# Altium project Capstone_Mainboard_B.PrjPcb (part 3 of 3)

## Sheet Management_RP2040_Support.SchDoc: Management Microcontroller Support
size B; CheckedBy: Jason Sullins; Author: Jordan Harris-Toovy; Revision: 0.2; SheetNumber: 3; SheetTotal: 22; Size: ANSI B
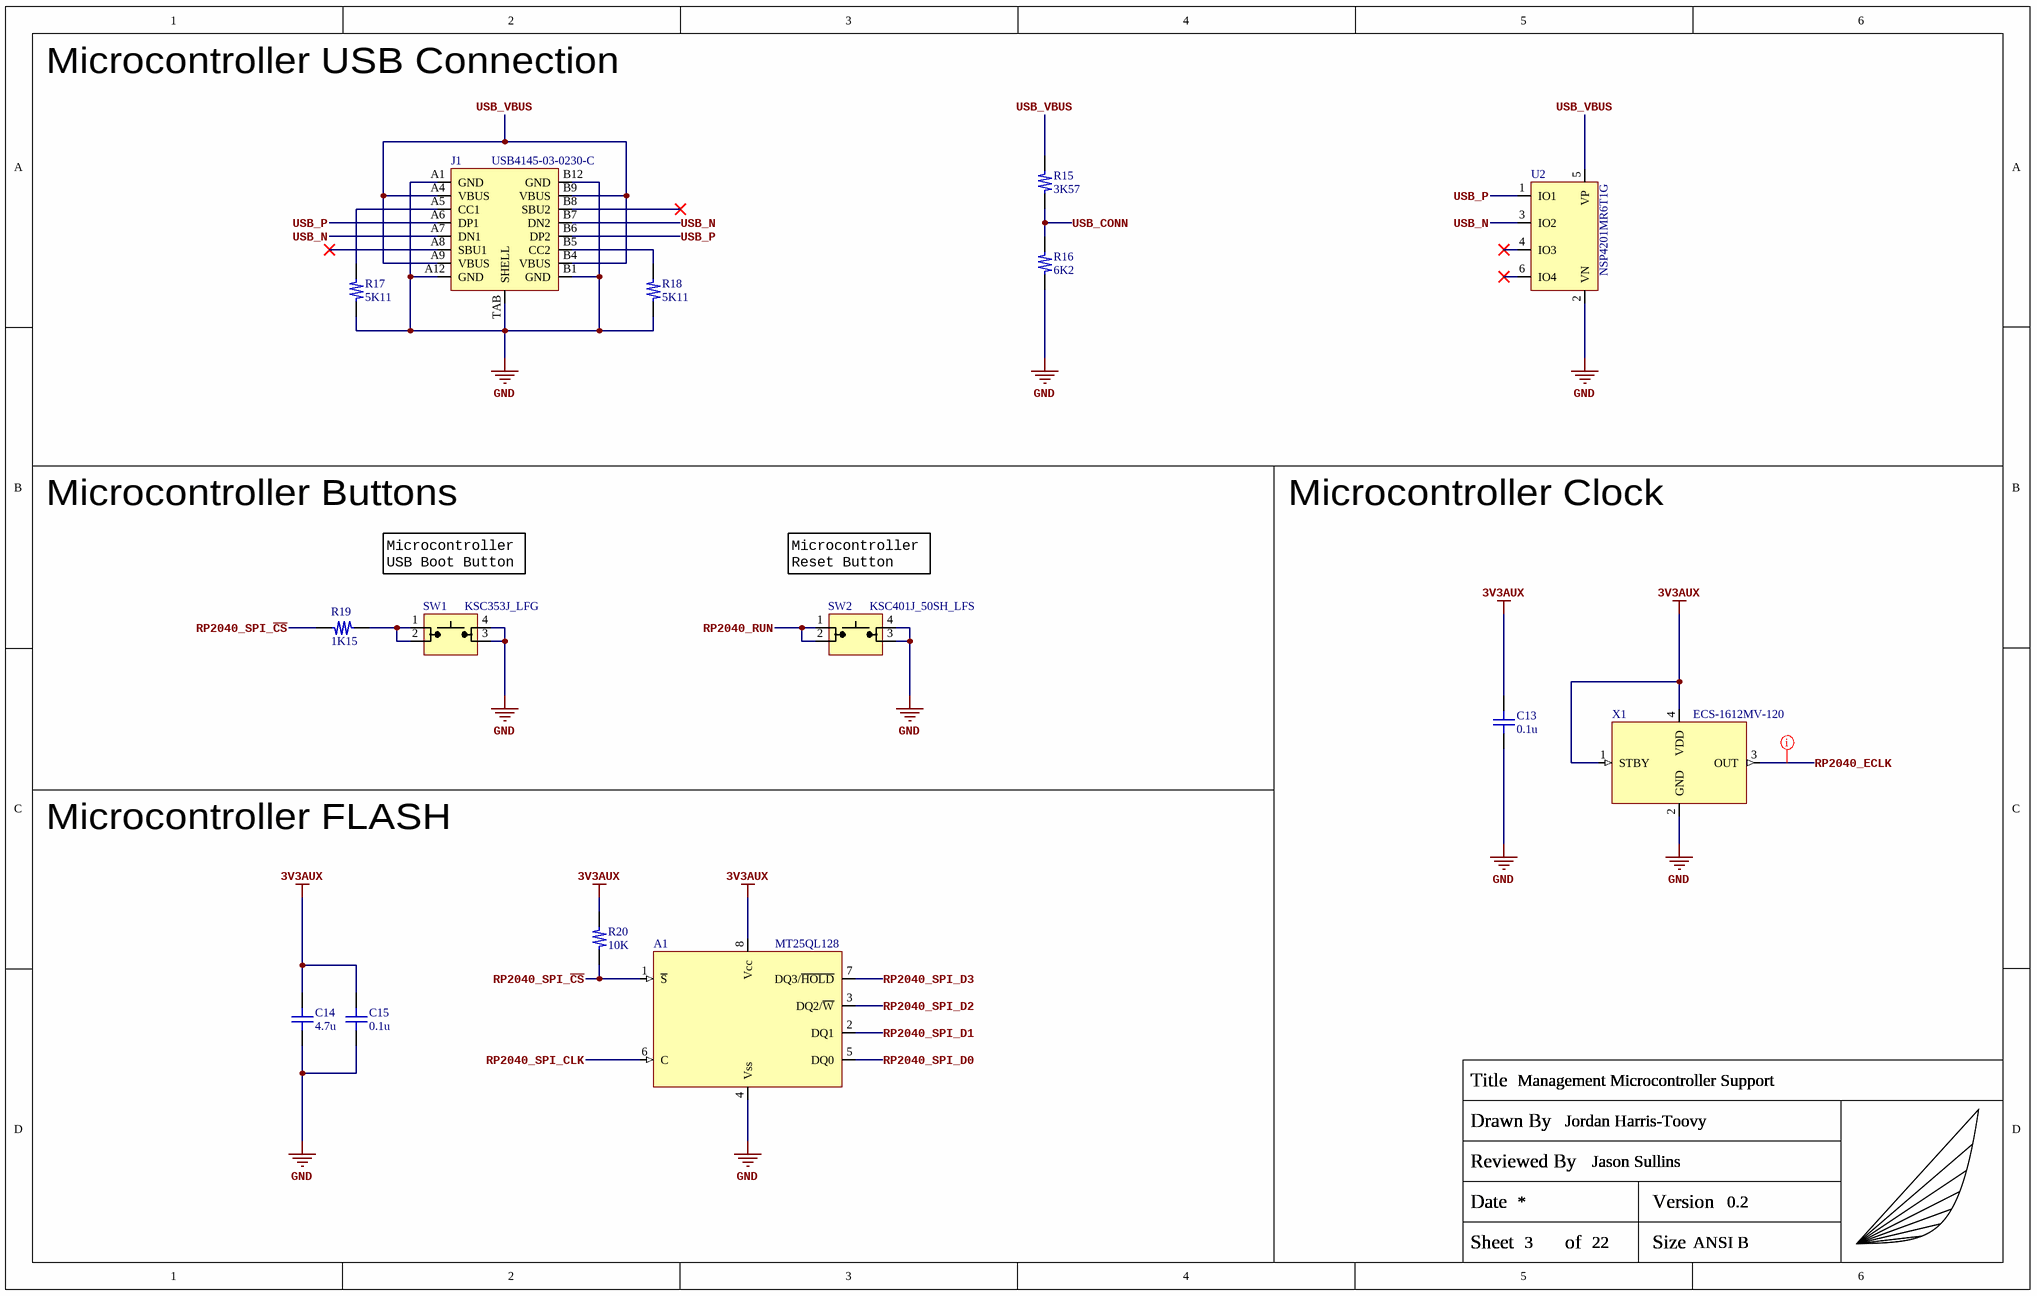
[diagram p20: Management_RP2040_Support.SchDoc]

### Parts
(Parts that share a designator on the sheet are numbered #1, #2 ... from top to bottom, then left to right.)
A1  MT25QL128  [LOTES_ACA-SPI-004-K01]
C13  0.1u  [C_0402_Generic]
C14  4.7u  [C_0402_Generic]
C15  0.1u  [C_0402_Generic]
J1  USB4145-03-0230-C  [USB4145-03-0230-C]
R15  3K57  [R_0402_Generic]
R16  6K2  [R_0402_Generic]
R17  5K11  [R_0402_Generic]
R18  5K11  [R_0402_Generic]
R19  1K15  [R_0402_Generic]
R20  10K  [R_0402_Generic]
SW1  KSC353J_LFG  [C&K_KSC_6.20]
SW2  KSC401J_50SH_LFS  [C&K_KSC_6.20]
TITLEBLOCK?#21  Capstone_Title_Block  (value not drawn)  (graphical)
U2  NSP4201MR6T1G  [ONSEMI_6-TSOP]
X1  ECS-1612MV-120  [ECS 4-SMD (1.6X1.2)]

### Nets
3V3AUX: A1.8(Vcc) C13.2 C14.2 C15.2 R20.2 X1.1(STBY) X1.4(VDD)
GND: A1.4(Vss) C13.1 C14.1 C15.1 J1.A1(GND) J1.A12(GND) J1.B1(GND) J1.B12(GND) J1.TAB(SHELL) R16.1 R17.1 R18.1 SW1.3(P3) SW1.4(P4) SW2.3(P3) SW2.4(P4) U2.2(VN) X1.2(GND)
RP2040_ECLK: X1.3(OUT)
RP2040_RUN: SW2.1(P1) SW2.2(P2)
RP2040_SPI_~{CS}: A1.1(~{S}) R19.2 R20.1
RP2040_SPI_CLK: A1.6(C)
RP2040_SPI_D0: A1.5(DQ0)
RP2040_SPI_D1: A1.2(DQ1)
RP2040_SPI_D2: A1.3(DQ2/~{W})
RP2040_SPI_D3: A1.7(DQ3/~{HOLD})
USB_CONN: R15.1 R16.2
USB_N: J1.A7(DN1) J1.B7(DN2) U2.3(IO2)
USB_P: J1.A6(DP1) J1.B6(DP2) U2.1(IO1)
USB_VBUS: J1.A4(VBUS) J1.A9(VBUS) J1.B4(VBUS) J1.B9(VBUS) R15.2 U2.5(VP)
NetJ1_A5: J1.A5(CC1) R17.2
NetJ1_B5: J1.B5(CC2) R18.2
NetR19_1: R19.1 SW1.1(P1) SW1.2(P2)

Not connected (* = marked no-connect by the designer): J1 A8(SBU1)* B8(SBU2)*; U2 4(IO3)* 6(IO4)*

### Layout directives
net class SE50_GENERAL: RP2040_ECLK

### Notes on the sheet
- Microcontroller USB Connection
- Microcontroller Buttons
- Microcontroller Clock
- Microcontroller USB Boot Button
- Microcontroller Reset Button
- Microcontroller FLASH
- (in symbol Capstone_Title_Block) Title; Drawn By; Reviewed By; Date; Version; Sheet; of; Size

### Library data of the parts
A1 = MT25QL128ABA1ESE_ACA-SPI-004: FLASH - NOR Memory IC 128Mbit SPI (Q)SPI 133 MHz 8-SO In ACA-SPI-004-K01 socket; Manufacturer: Micron Technology Inc; Manufacturer Part Number: MT25QL128ABA1ESE; Manufacturer2: LOTES; Manufacturer2 Part Number: ACA-SPI-004-K01
C13 C15 = GRM155R71C104KA88D: 0.1µF 16V X7R SMD ceramic capacitor in 0402 size; Manufacturer: Murata Electronics; Manufacturer Part Number: GRM155R71C104KA88D
C14 = GRM155R61A475MEAAJ: as C102-C104 on sheet FPGA_Power; Manufacturer Part Number: GRM155R61A475MEAAJ
J1 = USB4145-03-0230-C: USB 2.0 TYPE-C RECPT VERT XL TABS SMT; Manufacturer: GCT; Manufacturer Part Number: USB4145-03-0230-C
R15 = ERJ-2RKF3571X: 3.57KOhm 1% 1/10W SMD resistor in 0402 size; Manufacturer: Panasonic; Manufacturer Part Number: ERJ-2RKF3571X
R16 = ERJ-2RKF6201X: 6.2KOhm 1% 1/10W SMD resistor in 0402 size; Manufacturer: Panasonic; Manufacturer Part Number: ERJ-2RKF6201X
R17 R18 = ERJ-2RKF5111X: 5.11KOhm 1% 1/10W SMD resistor in 0402 size; Manufacturer: Panasonic; Manufacturer Part Number: ERJ-2RKF5111X
R19 = ERJ-2RKF1151X: 1.15KOhm 1% 1/10W SMD resistor in 0402 size; Manufacturer: Panasonic; Manufacturer Part Number: ERJ-2RKF1151X
R20 = ERJ-2RKF1002X: as R7-R14 on sheet Management_RP2040; Manufacturer Part Number: ERJ-2RKF1002X
SW1 = KSC353J_LFG: Tactile Switch SPST-NO (MOM) SMD back actuator; Manufacturer: C&K; Manufacturer Part Number: KSC353J LFG
SW2 = KSC401J_50SH_LFS: Tactile Switch SPST-NO (MOM) SMD red long actuator; Manufacturer: C&K; Manufacturer Part Number: KSC401J 50SH LFS
TITLEBLOCK?#21 = Capstone_Title_Block: Custom title block with personal logo; Manufacturer: NONE; Manufacturer Part Number: NONE
U2 = NSP4201MR6T1G: 4CH 6V Break 12V Clamp TVS Diode USB; Manufacturer: onsemi; Manufacturer Part Number: NSP4201MR6T1G
X1 = ECS-1612MV-120-CN-TR: 12 MHz XO (Standard) CMOS Oscillator 1.6V ~ 3.63V Standby (Power Down) 4-SMD, No Lead; Manufacturer: ECS Inc; Manufacturer Part Number: ECS-1612MV-120-CN-TR

## Sheet PMIC_3V3AUX_PWR-DEF.SchDoc: 3.3V Auxiliary Power Supply and Power Net Class Definitions
size B; CheckedBy: Jason Sullins; Author: Jordan Harris-Toovy; Revision: 0.2; SheetNumber: 15; SheetTotal: 22; Size: ANSI B
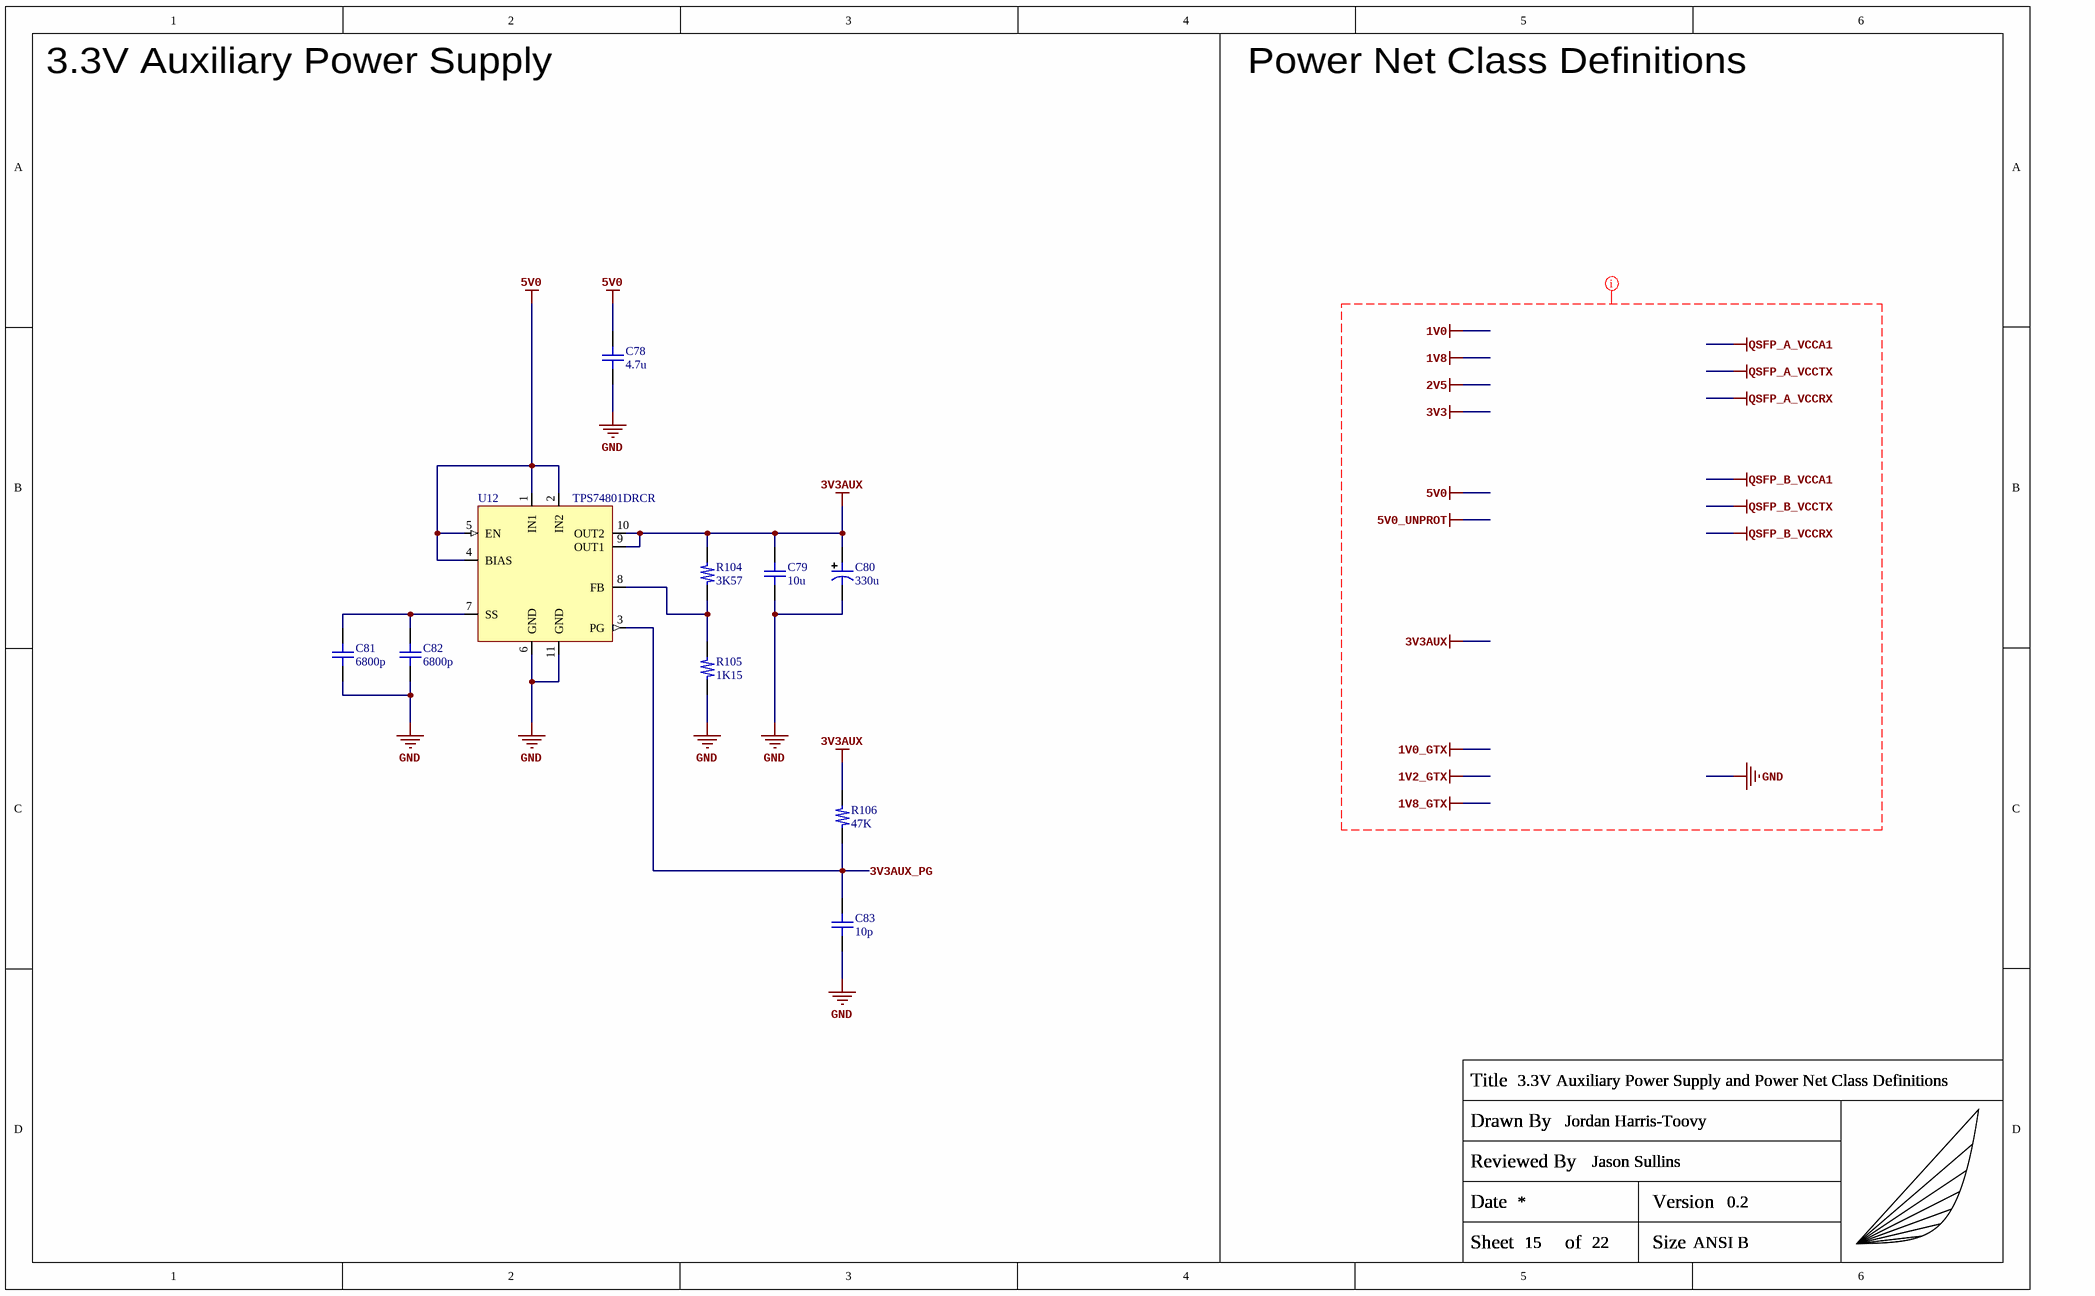
[diagram p21: PMIC_3V3AUX_PWR-DEF.SchDoc]

### Parts
(Parts that share a designator on the sheet are numbered #1, #2 ... from top to bottom, then left to right.)
C78  4.7u  [C_0402_Generic]
C79  10u  [C_0402_Generic]
C80  330u  [KEMET_EK_Radial]
C81  6800p  [C_0402_Generic]
C82  6800p  [C_0402_Generic]
C83  10p  [C_0402_Generic]
R104  3K57  [R_0402_Generic]
R105  1K15  [R_0402_Generic]
R106  47K  [R_0402_Generic]
TITLEBLOCK?#22  Capstone_Title_Block  (value not drawn)  (graphical)
U12  TPS74801DRCR  [TI_10VSON_DRC0010J_ADDVIA]

### Nets
3V3AUX: C79.2 C80.1 R104.2 R106.2 U12.9(OUT1) U12.10(OUT2)
5V0: C78.2 U12.1(IN1) U12.2(IN2) U12.4(BIAS) U12.5(EN)
GND: C78.1 C79.1 C80.2 C81.1 C82.1 C83.1 R105.1 U12.6(GND) U12.11(GND)
3V3AUX_PG: C83.2 R106.1 U12.3(PG)
NetC81_2: C81.2 C82.2 U12.7(SS)
NetR104_1: R104.1 R105.2 U12.8(FB)

### Layout directives
net class POWER: 1V0, 1V0_GTX, 1V2_GTX, 1V8, 1V8_GTX, 2V5, 3V3, 3V3AUX, 5V0, 5V0_UNPROT, GND, QSFP_A_VCCA1, QSFP_A_VCCRX, QSFP_A_VCCTX, QSFP_B_VCCA1, QSFP_B_VCCRX, QSFP_B_VCCTX

### Notes on the sheet
- 3.3V Auxiliary Power Supply
- Power Net Class Definitions
- (in symbol Capstone_Title_Block) Title; Drawn By; Reviewed By; Date; Version; Sheet; of; Size

### Library data of the parts
C78 = GRM155R61A475MEAAJ: as C102-C104 on sheet FPGA_Power; Manufacturer Part Number: GRM155R61A475MEAAJ
C79 = CC0402MRX5R6BB106: 10µF 10V X5R SMD ceramic capacitor in 0402 size; Manufacturer: YAGEO; Manufacturer Part Number: CC0402MRX5R6BB106
C80 = A759EK337M1AAAE018: 330µF 10V Aluminum polymer capacitor, KEMET EK; Manufacturer: KEMET; Manufacturer Part Number: A759EK337M1AAAE018
C81 C82 = GRM155R71E682KA01D: 6800pF 25V X7R SMD ceramic capacitor in 0402 size; Manufacturer: Murata Electronics; Manufacturer Part Number: GRM155R71E682KA01D
C83 = GRM1555C1H100JA01D: 10pF 50V C0G/NP0 SMD ceramic capacitor in 0402 size; Manufacturer: Murata Electronics; Manufacturer Part Number: GRM1555C1H100JA01D
R104 = ERJ-2RKF3571X: as R15 on sheet Management_RP2040_Support; Manufacturer Part Number: ERJ-2RKF3571X
R105 = ERJ-2RKF1151X: as R19 on sheet Management_RP2040_Support; Manufacturer Part Number: ERJ-2RKF1151X
R106 = ERJ-2RKF4702X: 47KOhm 1% 1/10W SMD resistor in 0402 size; Manufacturer: Panasonic; Manufacturer Part Number: ERJ-2RKF4702X
TITLEBLOCK?#22 = Capstone_Title_Block: as TITLEBLOCK?#21 on sheet Management_RP2040_Support; Manufacturer Part Number: NONE
U12 = TPS74801DRCR: LDO 1.5A 10-VSON; Manufacturer: Texas Instruments; Manufacturer Part Number: TPS74801DRCR

## Nets that join several sheets
1V0: PMIC_1V0 (5 pins), FPGA_Power (26 pins)
1V0_GTX: FPGA_Power (6 pins), PMIC_GTXs (6 pins)
1V2_GTX: FPGA_Power (8 pins), FPGA_GTXs (NT9.2), PMIC_GTXs (6 pins)
1V8: HPCC_Connector_A (6 pins), HPCC_Connector_B (6 pins), PMIC_1V8 (5 pins), FPGA_Power (32 pins), FPGA_HPCC_A_DPs (R119.2), PMIC_GTXs (10 pins)
1V8_GTX: FPGA_Power (C104.2 U16.N6), PMIC_GTXs (6 pins)
2V5: PMIC_2V5 (7 pins), FPGA_Power (20 pins), PMIC_GTXs (5 pins)
3V3: Flash_FPGA (7 pins), I2C_Switch_EEPROM (23 pins), QSFP_Connectors (16 pins), HPCC_Connector_A (12 pins), HPCC_Connector_B (12 pins), PMIC_3V3 (5 pins), FPGA_Power (18 pins), FGPA_Configuration (R117.2 R118.2 U16.P7), FPGA_GTXs (C120.1 U17.1 U17.6), Miscellaneous_Functions (11 pins)
3V3AUX: HPCC_Connector_A (J6.A11), HPCC_Connector_B (J7.A11), PMIC_3V3 (R102.2), PMIC_2V5 (R97.2), PMIC_1V8 (R90.2), PMIC_1V0 (R84.2), I2C_Temperature_Sensors (7 pins), Management_RP2040 (22 pins), Power_Input_Indicators (R24.2), PMIC_GTXs (11 pins), Management_RP2040_Support (7 pins), PMIC_3V3AUX_PWR-DEF (6 pins)
5V0: PMIC_3V3 (8 pins), PMIC_2V5 (8 pins), PMIC_1V8 (7 pins), PMIC_1V0 (7 pins), Power_Input_Indicators (15 pins), PMIC_3V3AUX_PWR-DEF (5 pins)
GND: Flash_FPGA (A2.4 C122.1), I2C_Switch_EEPROM (10 pins), QSFP_Connectors (64 pins), HPCC_Connector_A (209 pins), HPCC_Connector_B (209 pins), PMIC_3V3 (12 pins), PMIC_2V5 (14 pins), PMIC_1V8 (13 pins), PMIC_1V0 (13 pins), I2C_Temperature_Sensors (7 pins), Management_RP2040 (23 pins), FPGA_Power (138 pins), FGPA_Configuration (38 pins), FPGA_HPCC_A_DPs (5 pins), FPGA_HPCC_B_DPs (6 pins), FPGA_GTXs (C120.2 U17.3), Power_Input_Indicators (28 pins), Miscellaneous_Functions (25 pins), PMIC_GTXs (24 pins), Management_RP2040_Support (18 pins), PMIC_3V3AUX_PWR-DEF (9 pins)
1V0_EN: PMIC_1V0 (R80.2), Management_RP2040 (R7.2 U1.11)
1V0_GTX_EN: Management_RP2040 (R12.2 U1.16), PMIC_GTXs (U13.6)
1V0_GTX_PG: Management_RP2040 (U1.8), PMIC_GTXs (R107.1 U13.5)
1V0_PG: PMIC_1V0 (C48.2 R85.1), Management_RP2040 (U1.4)
1V2_GTX_EN: Management_RP2040 (R13.2 U1.17), PMIC_GTXs (U15.6)
1V2_GTX_PG: Management_RP2040 (U1.9), PMIC_GTXs (R113.1 U15.5)
1V8_EN: PMIC_1V8 (R86.2), Management_RP2040 (R9.2 U1.13)
1V8_GTX_EN: Management_RP2040 (R14.2 U1.18), PMIC_GTXs (U14.6)
1V8_PG: PMIC_1V8 (C57.2 R91.1), Management_RP2040 (U1.5)
2V5_EN: PMIC_2V5 (R92.2), Management_RP2040 (R10.2 U1.14)
2V5_PG: PMIC_2V5 (C68.2 R98.1), Management_RP2040 (U1.6)
3V3_EN: PMIC_3V3 (R99.2), Management_RP2040 (R11.2 U1.15)
3V3_PG: PMIC_3V3 (C77.2 R103.1), Management_RP2040 (U1.7)
3V3AUX_PG: Management_RP2040 (U1.3), PMIC_3V3AUX_PWR-DEF (C83.2 R106.1 U12.3)
EXT_CLK_IN: FGPA_Configuration (U16.G22), Miscellaneous_Functions (J11.1)
EXT_CONF_CLK_IN: FGPA_Configuration (U16.B26), Miscellaneous_Functions (J12.1)
FLASH_FPGA_C: Flash_FPGA (A2.6), FGPA_Configuration (U16.C8)
FLASH_FPGA_DQ0: Flash_FPGA (R130.1), FGPA_Configuration (U16.B24)
FLASH_FPGA_DQ1: Flash_FPGA (R129.1), FGPA_Configuration (U16.A25)
FLASH_FPGA_DQ2: Flash_FPGA (R128.1), FGPA_Configuration (U16.B22)
FLASH_FPGA_DQ3: Flash_FPGA (R127.1), FGPA_Configuration (U16.A22)
FLASH_FPGA_~{S}: Flash_FPGA (A2.1 R122.1), FGPA_Configuration (U16.C23)
FPGA_CK200_N: FGPA_Configuration (U16.E23), Miscellaneous_Functions (U18.5)
FPGA_CK200_P: FGPA_Configuration (U16.F22), Miscellaneous_Functions (U18.4)
FPGA_CONF_M0: FGPA_Configuration (U16.T5), Miscellaneous_Functions (R138.2 SW3.1)
FPGA_CONF_M1: FGPA_Configuration (U16.T2), Miscellaneous_Functions (R137.2 SW3.2)
FPGA_CONF_M2: FGPA_Configuration (U16.P5), Miscellaneous_Functions (R136.2 SW3.3)
FPGA_CONFDONE: Management_RP2040 (U1.30), FGPA_Configuration (U16.J7)
FPGA_INIT/CRCERR: Management_RP2040 (U1.31), FGPA_Configuration (R117.1 U16.G7), Miscellaneous_Functions (SW3.4)
FPGA_JTAG_TCK: FGPA_Configuration (U16.L8), Miscellaneous_Functions (J8.4)
FPGA_JTAG_TDI: FGPA_Configuration (U16.R6), Miscellaneous_Functions (J8.3)
FPGA_JTAG_TDO: FGPA_Configuration (U16.R7), Miscellaneous_Functions (J8.6)
FPGA_JTAG_TMS: FGPA_Configuration (U16.N8), Miscellaneous_Functions (J8.2)
FPGA_~{RESET}: Management_RP2040 (U1.32), FGPA_Configuration (R118.1 TP11.1 U16.P6)
HPCC_A_01_N: HPCC_Connector_A (J6.B21), FPGA_HPCC_A_DPs (U16.AE11)
HPCC_A_01_P: HPCC_Connector_A (J6.B20), FPGA_HPCC_A_DPs (U16.AD11)
HPCC_A_02_N: HPCC_Connector_A (J6.B25), FPGA_HPCC_A_DPs (U16.AF9)
HPCC_A_02_P: HPCC_Connector_A (J6.B24), FPGA_HPCC_A_DPs (U16.AF10)
HPCC_A_03_N: HPCC_Connector_A (J6.B29), FPGA_HPCC_A_DPs (U16.AF7)
HPCC_A_03_P: HPCC_Connector_A (J6.B28), FPGA_HPCC_A_DPs (U16.AE7)
HPCC_A_04_N: HPCC_Connector_A (J6.B33), FPGA_HPCC_A_DPs (U16.AE5)
HPCC_A_04_P: HPCC_Connector_A (J6.B32), FPGA_HPCC_A_DPs (U16.AE6)
HPCC_A_05_N: HPCC_Connector_A (J6.B37), FPGA_HPCC_A_DPs (U16.AE2)
HPCC_A_05_P: HPCC_Connector_A (J6.B36), FPGA_HPCC_A_DPs (U16.AE3)
HPCC_A_06_N: HPCC_Connector_A (J6.C3), FPGA_HPCC_A_DPs (U16.AE20)
HPCC_A_06_P: HPCC_Connector_A (J6.C2), FPGA_HPCC_A_DPs (U16.AD20)
HPCC_A_07_N: HPCC_Connector_A (J6.C7), FPGA_HPCC_A_DPs (U16.AF18)
HPCC_A_07_P: HPCC_Connector_A (J6.C6), FPGA_HPCC_A_DPs (U16.AE18)
HPCC_A_08_N: HPCC_Connector_A (J6.C11), FPGA_HPCC_A_DPs (U16.AE16)
HPCC_A_08_P: HPCC_Connector_A (J6.C10), FPGA_HPCC_A_DPs (U16.AD16)
HPCC_A_09_N: HPCC_Connector_A (J6.C15), FPGA_HPCC_A_DPs (U16.AF15)
HPCC_A_09_P: HPCC_Connector_A (J6.C14), FPGA_HPCC_A_DPs (U16.AF14)
HPCC_A_10_N: HPCC_Connector_A (J6.C19), FPGA_HPCC_A_DPs (U16.AF12)
HPCC_A_10_P: HPCC_Connector_A (J6.C18), FPGA_HPCC_A_DPs (U16.AE12)
HPCC_A_11_N: HPCC_Connector_A (J6.C23), FPGA_HPCC_A_DPs (U16.AE10)
HPCC_A_11_P: HPCC_Connector_A (J6.C22), FPGA_HPCC_A_DPs (U16.AD10)
HPCC_A_12_N: HPCC_Connector_A (J6.C27), FPGA_HPCC_A_DPs (U16.AF8)
HPCC_A_12_P: HPCC_Connector_A (J6.C26), FPGA_HPCC_A_DPs (U16.AE8)
HPCC_A_13_N: HPCC_Connector_A (J6.C31), FPGA_HPCC_A_DPs (U16.AD5)
HPCC_A_13_P: HPCC_Connector_A (J6.C30), FPGA_HPCC_A_DPs (U16.AD6)
HPCC_A_14_N: HPCC_Connector_A (J6.C35), FPGA_HPCC_A_DPs (U16.AF4)
HPCC_A_14_P: HPCC_Connector_A (J6.C34), FPGA_HPCC_A_DPs (U16.AF5)
HPCC_A_15_N: HPCC_Connector_A (J6.C39), FPGA_HPCC_A_DPs (U16.AE1)
HPCC_A_15_P: HPCC_Connector_A (J6.C38), FPGA_HPCC_A_DPs (U16.AD1)
HPCC_A_16_N: HPCC_Connector_A (J6.D5), FPGA_HPCC_A_DPs (U16.AF20)
HPCC_A_16_P: HPCC_Connector_A (J6.D4), FPGA_HPCC_A_DPs (U16.AF19)
HPCC_A_17_N: HPCC_Connector_A (J6.D9), FPGA_HPCC_A_DPs (U16.AF17)
HPCC_A_17_P: HPCC_Connector_A (J6.D8), FPGA_HPCC_A_DPs (U16.AE17)
HPCC_A_18_N: HPCC_Connector_A (J6.D13), FPGA_HPCC_A_DPs (U16.AE15)
HPCC_A_18_P: HPCC_Connector_A (J6.D12), FPGA_HPCC_A_DPs (U16.AD15)
HPCC_A_19_N: HPCC_Connector_A (J6.D17), FPGA_HPCC_A_DPs (U16.AF13)
HPCC_A_19_P: HPCC_Connector_A (J6.D16), FPGA_HPCC_A_DPs (U16.AE13)
HPCC_A_20_N: HPCC_Connector_A (J6.D21), FPGA_HPCC_A_DPs (U16.AB10)
HPCC_A_20_P: HPCC_Connector_A (J6.D20), FPGA_HPCC_A_DPs (U16.AA10)
HPCC_A_21_N: HPCC_Connector_A (J6.D25), FPGA_HPCC_A_DPs (U16.AD8)
HPCC_A_21_P: HPCC_Connector_A (J6.D24), FPGA_HPCC_A_DPs (U16.AC8)
HPCC_A_22_N: HPCC_Connector_A (J6.D29), FPGA_HPCC_A_DPs (U16.AC6)
HPCC_A_22_P: HPCC_Connector_A (J6.D28), FPGA_HPCC_A_DPs (U16.AB6)
HPCC_A_23_N: HPCC_Connector_A (J6.D33), FPGA_HPCC_A_DPs (U16.AC3)
HPCC_A_23_P: HPCC_Connector_A (J6.D32), FPGA_HPCC_A_DPs (U16.AC4)
HPCC_A_24_N: HPCC_Connector_A (J6.D37), FPGA_HPCC_A_DPs (U16.AC2)
HPCC_A_24_P: HPCC_Connector_A (J6.D36), FPGA_HPCC_A_DPs (U16.AB2)
HPCC_A_25_N: HPCC_Connector_A (J6.E3), FPGA_HPCC_A_DPs (U16.AB20)
HPCC_A_25_P: HPCC_Connector_A (J6.E2), FPGA_HPCC_A_DPs (U16.AB19)
HPCC_A_26_N: HPCC_Connector_A (J6.E7), FPGA_HPCC_A_DPs (U16.AC17)
HPCC_A_26_P: HPCC_Connector_A (J6.E6), FPGA_HPCC_A_DPs (U16.AB17)
HPCC_A_27_N: HPCC_Connector_A (J6.E11), FPGA_HPCC_A_DPs (U16.AB15)
HPCC_A_27_P: HPCC_Connector_A (J6.E10), FPGA_HPCC_A_DPs (U16.AB14)
HPCC_A_28_N: HPCC_Connector_A (J6.E15), FPGA_HPCC_A_DPs (U16.AD13)
HPCC_A_28_P: HPCC_Connector_A (J6.E14), FPGA_HPCC_A_DPs (U16.AC13)
HPCC_A_29_N: HPCC_Connector_A (J6.E19), FPGA_HPCC_A_DPs (U16.AC11)
HPCC_A_29_P: HPCC_Connector_A (J6.E18), FPGA_HPCC_A_DPs (U16.AB11)
HPCC_A_30_N: HPCC_Connector_A (J6.E23), FPGA_HPCC_A_DPs (U16.AD9)
HPCC_A_30_P: HPCC_Connector_A (J6.E22), FPGA_HPCC_A_DPs (U16.AC9)
HPCC_A_31_N: HPCC_Connector_A (J6.E27), FPGA_HPCC_A_DPs (U16.AC7)
HPCC_A_31_P: HPCC_Connector_A (J6.E26), FPGA_HPCC_A_DPs (U16.AB7)
HPCC_A_32_N: HPCC_Connector_A (J6.E31), FPGA_HPCC_A_DPs (U16.AB5)
HPCC_A_32_P: HPCC_Connector_A (J6.E30), FPGA_HPCC_A_DPs (U16.AA5)
HPCC_A_33_N: HPCC_Connector_A (J6.E35), FPGA_HPCC_A_DPs (U16.AD3)
HPCC_A_33_P: HPCC_Connector_A (J6.E34), FPGA_HPCC_A_DPs (U16.AD4)
HPCC_A_34_N: HPCC_Connector_A (J6.E39), FPGA_HPCC_A_DPs (U16.AF2)
HPCC_A_34_P: HPCC_Connector_A (J6.E38), FPGA_HPCC_A_DPs (U16.AF3)
HPCC_A_35_N: HPCC_Connector_A (J6.F5), FPGA_HPCC_A_DPs (U16.AD18)
HPCC_A_35_P: HPCC_Connector_A (J6.F4), FPGA_HPCC_A_DPs (U16.AC18)
HPCC_A_36_N: HPCC_Connector_A (J6.F9), FPGA_HPCC_A_DPs (U16.AC16)
HPCC_A_36_P: HPCC_Connector_A (J6.F8), FPGA_HPCC_A_DPs (U16.AB16)
HPCC_A_37_N: HPCC_Connector_A (J6.F13), FPGA_HPCC_A_DPs (U16.AD14)
HPCC_A_37_P: HPCC_Connector_A (J6.F12), FPGA_HPCC_A_DPs (U16.AC14)
HPCC_A_38_N: HPCC_Connector_A (J6.F17), FPGA_HPCC_A_DPs (U16.AC12)
HPCC_A_38_P: HPCC_Connector_A (J6.F16), FPGA_HPCC_A_DPs (U16.AB12)
HPCC_A_39_N: HPCC_Connector_A (J6.F21), FPGA_HPCC_A_DPs (U16.Y12)
HPCC_A_39_P: HPCC_Connector_A (J6.F20), FPGA_HPCC_A_DPs (U16.Y13)
HPCC_A_40_N: HPCC_Connector_A (J6.F25), FPGA_HPCC_A_DPs (U16.AB9)
HPCC_A_40_P: HPCC_Connector_A (J6.F24), FPGA_HPCC_A_DPs (U16.AA9)
HPCC_A_41_N: HPCC_Connector_A (J6.F29), FPGA_HPCC_A_DPs (U16.AA7)
HPCC_A_41_P: HPCC_Connector_A (J6.F28), FPGA_HPCC_A_DPs (U16.AA8)
HPCC_A_42_N: HPCC_Connector_A (J6.F33), FPGA_HPCC_A_DPs (U16.Y5)
HPCC_A_42_P: HPCC_Connector_A (J6.F32), FPGA_HPCC_A_DPs (U16.Y6)
HPCC_A_43_N: HPCC_Connector_A (J6.F37), FPGA_HPCC_A_DPs (U16.AA2)
HPCC_A_43_P: HPCC_Connector_A (J6.F36), FPGA_HPCC_A_DPs (U16.AA3)
HPCC_A_44_N: HPCC_Connector_A (J6.G3), FPGA_HPCC_A_DPs (U16.AD19)
HPCC_A_44_P: HPCC_Connector_A (J6.G2), FPGA_HPCC_A_DPs (U16.AC19)
HPCC_A_45_N: HPCC_Connector_A (J6.G7), FPGA_HPCC_A_DPs (U16.AA20)
HPCC_A_45_P: HPCC_Connector_A (J6.G6), FPGA_HPCC_A_DPs (U16.AA19)
HPCC_A_46_N: HPCC_Connector_A (J6.G11), FPGA_HPCC_A_DPs (U16.AA18)
HPCC_A_46_P: HPCC_Connector_A (J6.G10), FPGA_HPCC_A_DPs (U16.AA17)
HPCC_A_47_N: HPCC_Connector_A (J6.G15), FPGA_HPCC_A_DPs (U16.Y16)
HPCC_A_47_P: HPCC_Connector_A (J6.G14), FPGA_HPCC_A_DPs (U16.Y15)
HPCC_A_48_N: HPCC_Connector_A (J6.G19), FPGA_HPCC_A_DPs (U16.AA12)
HPCC_A_48_P: HPCC_Connector_A (J6.G18), FPGA_HPCC_A_DPs (U16.AA13)
HPCC_A_49_N: HPCC_Connector_A (J6.G23), FPGA_HPCC_A_DPs (U16.Y10)
HPCC_A_49_P: HPCC_Connector_A (J6.G22), FPGA_HPCC_A_DPs (U16.Y11)
HPCC_A_50_N: HPCC_Connector_A (J6.G27), FPGA_HPCC_A_DPs (U16.Y7)
HPCC_A_50_P: HPCC_Connector_A (J6.G26), FPGA_HPCC_A_DPs (U16.Y8)
HPCC_A_51_N: HPCC_Connector_A (J6.G31), FPGA_HPCC_A_DPs (U16.W5)
HPCC_A_51_P: HPCC_Connector_A (J6.G30), FPGA_HPCC_A_DPs (U16.W6)
HPCC_A_52_N: HPCC_Connector_A (J6.G35), FPGA_HPCC_A_DPs (U16.AB4)
HPCC_A_52_P: HPCC_Connector_A (J6.G34), FPGA_HPCC_A_DPs (U16.AA4)
HPCC_A_53_N: HPCC_Connector_A (J6.G39), FPGA_HPCC_A_DPs (U16.AC1)
HPCC_A_53_P: HPCC_Connector_A (J6.G38), FPGA_HPCC_A_DPs (U16.AB1)
HPCC_A_54_N: HPCC_Connector_A (J6.H5), FPGA_HPCC_A_DPs (U16.W19)
HPCC_A_54_P: HPCC_Connector_A (J6.H4), FPGA_HPCC_A_DPs (U16.W18)
HPCC_A_55_N: HPCC_Connector_A (J6.H9), FPGA_HPCC_A_DPs (U16.Y18)
HPCC_A_55_P: HPCC_Connector_A (J6.H8), FPGA_HPCC_A_DPs (U16.Y17)
HPCC_A_56_N: HPCC_Connector_A (J6.H13), FPGA_HPCC_A_DPs (U16.V17)
HPCC_A_56_P: HPCC_Connector_A (J6.H12), FPGA_HPCC_A_DPs (U16.V16)
HPCC_A_57_N: HPCC_Connector_A (J6.H17), FPGA_HPCC_A_DPs (U16.AA15)
HPCC_A_57_P: HPCC_Connector_A (J6.H16), FPGA_HPCC_A_DPs (U16.AA14)
HPCC_A_58_N: HPCC_Connector_A (J6.H21), FPGA_HPCC_A_DPs (U16.W8)
HPCC_A_58_P: HPCC_Connector_A (J6.H20), FPGA_HPCC_A_DPs (U16.V9)
HPCC_A_59_N: HPCC_Connector_A (J6.H25), FPGA_HPCC_A_DPs (U16.V6)
HPCC_A_59_P: HPCC_Connector_A (J6.H24), FPGA_HPCC_A_DPs (U16.U7)
HPCC_A_60_N: HPCC_Connector_A (J6.H29), FPGA_HPCC_A_DPs (U16.W4)
HPCC_A_60_P: HPCC_Connector_A (J6.H28), FPGA_HPCC_A_DPs (U16.V4)
HPCC_A_61_N: HPCC_Connector_A (J6.H33), FPGA_HPCC_A_DPs (U16.U1)
HPCC_A_61_P: HPCC_Connector_A (J6.H32), FPGA_HPCC_A_DPs (U16.U2)
HPCC_A_62_N: HPCC_Connector_A (J6.H37), FPGA_HPCC_A_DPs (U16.Y2)
HPCC_A_62_P: HPCC_Connector_A (J6.H36), FPGA_HPCC_A_DPs (U16.Y3)
HPCC_A_63_N: HPCC_Connector_A (J6.J3), FPGA_HPCC_A_DPs (U16.V19)
HPCC_A_63_P: HPCC_Connector_A (J6.J2), FPGA_HPCC_A_DPs (U16.V18)
HPCC_A_64_N: HPCC_Connector_A (J6.J7), FPGA_HPCC_A_DPs (U16.W16)
HPCC_A_64_P: HPCC_Connector_A (J6.J6), FPGA_HPCC_A_DPs (U16.W15)
HPCC_A_65_N: HPCC_Connector_A (J6.J11), FPGA_HPCC_A_DPs (U16.W14)
HPCC_A_65_P: HPCC_Connector_A (J6.J10), FPGA_HPCC_A_DPs (U16.V14)
HPCC_A_66_N: HPCC_Connector_A (J6.J15), FPGA_HPCC_A_DPs (U16.W11)
HPCC_A_66_P: HPCC_Connector_A (J6.J14), FPGA_HPCC_A_DPs (U16.V11)
HPCC_A_67_N: HPCC_Connector_A (J6.J19), FPGA_HPCC_A_DPs (U16.W9)
HPCC_A_67_P: HPCC_Connector_A (J6.J18), FPGA_HPCC_A_DPs (U16.W10)
HPCC_A_68_N: HPCC_Connector_A (J6.J23), FPGA_HPCC_A_DPs (U16.V7)
HPCC_A_68_P: HPCC_Connector_A (J6.J22), FPGA_HPCC_A_DPs (U16.V8)
HPCC_A_69_N: HPCC_Connector_A (J6.J27), FPGA_HPCC_A_DPs (U16.U5)
HPCC_A_69_P: HPCC_Connector_A (J6.J26), FPGA_HPCC_A_DPs (U16.U6)
HPCC_A_70_N: HPCC_Connector_A (J6.J31), FPGA_HPCC_A_DPs (U16.W3)
HPCC_A_70_P: HPCC_Connector_A (J6.J30), FPGA_HPCC_A_DPs (U16.V3)
HPCC_A_71_N: HPCC_Connector_A (J6.J35), FPGA_HPCC_A_DPs (U16.V1)
HPCC_A_71_P: HPCC_Connector_A (J6.J34), FPGA_HPCC_A_DPs (U16.V2)
HPCC_A_72_N: HPCC_Connector_A (J6.J39), FPGA_HPCC_A_DPs (U16.Y1)
HPCC_A_72_P: HPCC_Connector_A (J6.J38), FPGA_HPCC_A_DPs (U16.W1)
HPCC_A_GP01: HPCC_Connector_A (J6.A18), FGPA_Configuration (U16.AD25)
HPCC_A_GP02: HPCC_Connector_A (J6.A19), FGPA_Configuration (U16.AE25)
HPCC_A_GP03: HPCC_Connector_A (J6.A22), FGPA_Configuration (U16.W20)
HPCC_A_GP04: HPCC_Connector_A (J6.A23), FGPA_Configuration (U16.AC21)
HPCC_A_GP05: HPCC_Connector_A (J6.A26), FGPA_Configuration (U16.AF25)
HPCC_A_GP06: HPCC_Connector_A (J6.A27), FGPA_Configuration (U16.AF24)
HPCC_A_GP07: HPCC_Connector_A (J6.A30), FGPA_Configuration (U16.AE21)
HPCC_A_GP08: HPCC_Connector_A (J6.A31), FGPA_Configuration (U16.AD21)
HPCC_A_GP09: HPCC_Connector_A (J6.A34), FGPA_Configuration (U16.AB21)
HPCC_A_GP10: HPCC_Connector_A (J6.A35), FGPA_Configuration (U16.AC24)
HPCC_A_GP11: HPCC_Connector_A (J6.A38), FGPA_Configuration (U16.AD24)
HPCC_A_GP12: HPCC_Connector_A (J6.A39), FGPA_Configuration (U16.AD23)
HPCC_A_GP13: HPCC_Connector_A (J6.B4), FGPA_Configuration (U16.AC23)
HPCC_A_GP14: HPCC_Connector_A (J6.B5), FGPA_Configuration (U16.AE23)
HPCC_A_GP15: HPCC_Connector_A (J6.B8), FGPA_Configuration (U16.Y21)
HPCC_A_GP16: HPCC_Connector_A (J6.B9), FGPA_Configuration (U16.AF23)
HPCC_A_GP17: HPCC_Connector_A (J6.B12), FGPA_Configuration (U16.AC22)
HPCC_A_GP18: HPCC_Connector_A (J6.B13), FGPA_Configuration (U16.AE26)
HPCC_A_GP19: HPCC_Connector_A (J6.B16), FGPA_Configuration (U16.AB22)
HPCC_A_GP20: HPCC_Connector_A (J6.B17), FGPA_Configuration (U16.AD26)
HPCC_A_I2C_SCL: I2C_Switch_EEPROM (R41.1 U3.2), HPCC_Connector_A (J6.A14)
HPCC_A_I2C_SDA: I2C_Switch_EEPROM (R40.1 U3.1), HPCC_Connector_A (J6.A15)
HPCC_A_JTAG_TCK: HPCC_Connector_A (J6.A3), Miscellaneous_Functions (J9.4)
HPCC_A_JTAG_TDI: HPCC_Connector_A (J6.A7), Miscellaneous_Functions (J9.3)
HPCC_A_JTAG_TDO: HPCC_Connector_A (J6.A6), Miscellaneous_Functions (J9.6)
HPCC_A_JTAG_TMS: HPCC_Connector_A (J6.A2), Miscellaneous_Functions (J9.2)
HPCC_A_JTAG_TRST: HPCC_Connector_A (J6.A10), Miscellaneous_Functions (R134.2)
HPCC_B_01_N: HPCC_Connector_B (J7.B21), FPGA_HPCC_B_DPs (U16.A19)
HPCC_B_01_P: HPCC_Connector_B (J7.B20), FPGA_HPCC_B_DPs (U16.A18)
HPCC_B_02_N: HPCC_Connector_B (J7.B25), FPGA_HPCC_B_DPs (U16.D20)
HPCC_B_02_P: HPCC_Connector_B (J7.B24), FPGA_HPCC_B_DPs (U16.D19)
HPCC_B_03_N: HPCC_Connector_B (J7.B29), FPGA_HPCC_B_DPs (U16.K26)
HPCC_B_03_P: HPCC_Connector_B (J7.B28), FPGA_HPCC_B_DPs (U16.K25)
HPCC_B_04_N: HPCC_Connector_B (J7.B33), FPGA_HPCC_B_DPs (U16.L25)
HPCC_B_04_P: HPCC_Connector_B (J7.B32), FPGA_HPCC_B_DPs (U16.M25)
HPCC_B_05_N: HPCC_Connector_B (J7.B37), FPGA_HPCC_B_DPs (U16.P25)
HPCC_B_05_P: HPCC_Connector_B (J7.B36), FPGA_HPCC_B_DPs (U16.R25)
HPCC_B_06_N: HPCC_Connector_B (J7.C3), FPGA_HPCC_B_DPs (U16.B9)
HPCC_B_06_P: HPCC_Connector_B (J7.C2), FPGA_HPCC_B_DPs (U16.C9)
HPCC_B_07_N: HPCC_Connector_B (J7.C7), FPGA_HPCC_B_DPs (U16.B11)
HPCC_B_07_P: HPCC_Connector_B (J7.C6), FPGA_HPCC_B_DPs (U16.B12)
HPCC_B_08_N: HPCC_Connector_B (J7.C11), FPGA_HPCC_B_DPs (U16.C13)
HPCC_B_08_P: HPCC_Connector_B (J7.C10), FPGA_HPCC_B_DPs (U16.C14)
HPCC_B_09_N: HPCC_Connector_B (J7.C15), FPGA_HPCC_B_DPs (U16.A15)
HPCC_B_09_P: HPCC_Connector_B (J7.C14), FPGA_HPCC_B_DPs (U16.B15)
HPCC_B_10_N: HPCC_Connector_B (J7.C19), FPGA_HPCC_B_DPs (U16.A17)
HPCC_B_10_P: HPCC_Connector_B (J7.C18), FPGA_HPCC_B_DPs (U16.B17)
HPCC_B_11_N: HPCC_Connector_B (J7.C23), FPGA_HPCC_B_DPs (U16.B19)
HPCC_B_11_P: HPCC_Connector_B (J7.C22), FPGA_HPCC_B_DPs (U16.C19)
HPCC_B_12_N: HPCC_Connector_B (J7.C27), FPGA_HPCC_B_DPs (U16.E20)
HPCC_B_12_P: HPCC_Connector_B (J7.C26), FPGA_HPCC_B_DPs (U16.F19)
HPCC_B_13_N: HPCC_Connector_B (J7.C31), FPGA_HPCC_B_DPs (U16.L24)
HPCC_B_13_P: HPCC_Connector_B (J7.C30), FPGA_HPCC_B_DPs (U16.M24)
HPCC_B_14_N: HPCC_Connector_B (J7.C35), FPGA_HPCC_B_DPs (U16.M26)
HPCC_B_14_P: HPCC_Connector_B (J7.C34), FPGA_HPCC_B_DPs (U16.N26)
HPCC_B_15_N: HPCC_Connector_B (J7.C39), FPGA_HPCC_B_DPs (U16.T25)
HPCC_B_15_P: HPCC_Connector_B (J7.C38), FPGA_HPCC_B_DPs (U16.T24)
HPCC_B_16_N: HPCC_Connector_B (J7.D5), FPGA_HPCC_B_DPs (U16.A10)
HPCC_B_16_P: HPCC_Connector_B (J7.D4), FPGA_HPCC_B_DPs (U16.B10)
HPCC_B_17_N: HPCC_Connector_B (J7.D9), FPGA_HPCC_B_DPs (U16.A12)
HPCC_B_17_P: HPCC_Connector_B (J7.D8), FPGA_HPCC_B_DPs (U16.A13)
HPCC_B_18_N: HPCC_Connector_B (J7.D13), FPGA_HPCC_B_DPs (U16.A14)
HPCC_B_18_P: HPCC_Connector_B (J7.D12), FPGA_HPCC_B_DPs (U16.B14)
HPCC_B_19_N: HPCC_Connector_B (J7.D17), FPGA_HPCC_B_DPs (U16.B16)
HPCC_B_19_P: HPCC_Connector_B (J7.D16), FPGA_HPCC_B_DPs (U16.C16)
HPCC_B_20_N: HPCC_Connector_B (J7.D21), FPGA_HPCC_B_DPs (U16.D18)
HPCC_B_20_P: HPCC_Connector_B (J7.D20), FPGA_HPCC_B_DPs (U16.E18)
HPCC_B_21_N: HPCC_Connector_B (J7.D25), FPGA_HPCC_B_DPs (U16.J19)
HPCC_B_21_P: HPCC_Connector_B (J7.D24), FPGA_HPCC_B_DPs (U16.J18)
HPCC_B_22_N: HPCC_Connector_B (J7.D29), FPGA_HPCC_B_DPs (U16.L20)
HPCC_B_22_P: HPCC_Connector_B (J7.D28), FPGA_HPCC_B_DPs (U16.L19)
HPCC_B_23_N: HPCC_Connector_B (J7.D33), FPGA_HPCC_B_DPs (U16.N23)
HPCC_B_23_P: HPCC_Connector_B (J7.D32), FPGA_HPCC_B_DPs (U16.P23)
HPCC_B_24_N: HPCC_Connector_B (J7.D37), FPGA_HPCC_B_DPs (U16.R23)
HPCC_B_24_P: HPCC_Connector_B (J7.D36), FPGA_HPCC_B_DPs (U16.R22)
HPCC_B_25_N: HPCC_Connector_B (J7.E3), FPGA_HPCC_B_DPs (U16.D8)
HPCC_B_25_P: HPCC_Connector_B (J7.E2), FPGA_HPCC_B_DPs (U16.D9)
HPCC_B_26_N: HPCC_Connector_B (J7.E7), FPGA_HPCC_B_DPs (U16.C11)
HPCC_B_26_P: HPCC_Connector_B (J7.E6), FPGA_HPCC_B_DPs (U16.C12)
HPCC_B_27_N: HPCC_Connector_B (J7.E11), FPGA_HPCC_B_DPs (U16.D13)
HPCC_B_27_P: HPCC_Connector_B (J7.E10), FPGA_HPCC_B_DPs (U16.D14)
HPCC_B_28_N: HPCC_Connector_B (J7.E15), FPGA_HPCC_B_DPs (U16.D16)
HPCC_B_28_P: HPCC_Connector_B (J7.E14), FPGA_HPCC_B_DPs (U16.D15)
HPCC_B_29_N: HPCC_Connector_B (J7.E19), FPGA_HPCC_B_DPs (U16.C18)
HPCC_B_29_P: HPCC_Connector_B (J7.E18), FPGA_HPCC_B_DPs (U16.C17)
HPCC_B_30_N: HPCC_Connector_B (J7.E23), FPGA_HPCC_B_DPs (U16.G20)
HPCC_B_30_P: HPCC_Connector_B (J7.E22), FPGA_HPCC_B_DPs (U16.H19)
HPCC_B_31_N: HPCC_Connector_B (J7.E27), FPGA_HPCC_B_DPs (U16.J20)
HPCC_B_31_P: HPCC_Connector_B (J7.E26), FPGA_HPCC_B_DPs (U16.K20)
HPCC_B_32_N: HPCC_Connector_B (J7.E31), FPGA_HPCC_B_DPs (U16.M22)
HPCC_B_32_P: HPCC_Connector_B (J7.E30), FPGA_HPCC_B_DPs (U16.M21)
HPCC_B_33_N: HPCC_Connector_B (J7.E35), FPGA_HPCC_B_DPs (U16.N24)
HPCC_B_33_P: HPCC_Connector_B (J7.E34), FPGA_HPCC_B_DPs (U16.P24)
HPCC_B_34_N: HPCC_Connector_B (J7.E39), FPGA_HPCC_B_DPs (U16.P26)
HPCC_B_34_P: HPCC_Connector_B (J7.E38), FPGA_HPCC_B_DPs (U16.R26)
HPCC_B_35_N: HPCC_Connector_B (J7.F5), FPGA_HPCC_B_DPs (U16.D11)
HPCC_B_35_P: HPCC_Connector_B (J7.F4), FPGA_HPCC_B_DPs (U16.E11)
HPCC_B_36_N: HPCC_Connector_B (J7.F9), FPGA_HPCC_B_DPs (U16.E12)
HPCC_B_36_P: HPCC_Connector_B (J7.F8), FPGA_HPCC_B_DPs (U16.E13)
HPCC_B_37_N: HPCC_Connector_B (J7.F13), FPGA_HPCC_B_DPs (U16.E16)
HPCC_B_37_P: HPCC_Connector_B (J7.F12), FPGA_HPCC_B_DPs (U16.E15)
HPCC_B_38_N: HPCC_Connector_B (J7.F17), FPGA_HPCC_B_DPs (U16.E17)
HPCC_B_38_P: HPCC_Connector_B (J7.F16), FPGA_HPCC_B_DPs (U16.F17)
HPCC_B_39_N: HPCC_Connector_B (J7.F21), FPGA_HPCC_B_DPs (U16.F18)
HPCC_B_39_P: HPCC_Connector_B (J7.F20), FPGA_HPCC_B_DPs (U16.G17)
HPCC_B_40_N: HPCC_Connector_B (J7.F25), FPGA_HPCC_B_DPs (U16.K17)
HPCC_B_40_P: HPCC_Connector_B (J7.F24), FPGA_HPCC_B_DPs (U16.K16)
HPCC_B_41_N: HPCC_Connector_B (J7.F29), FPGA_HPCC_B_DPs (U16.L18)
HPCC_B_41_P: HPCC_Connector_B (J7.F28), FPGA_HPCC_B_DPs (U16.M17)
HPCC_B_42_N: HPCC_Connector_B (J7.F33), FPGA_HPCC_B_DPs (U16.N22)
HPCC_B_42_P: HPCC_Connector_B (J7.F32), FPGA_HPCC_B_DPs (U16.N21)
HPCC_B_43_N: HPCC_Connector_B (J7.F37), FPGA_HPCC_B_DPs (U16.T19)
HPCC_B_43_P: HPCC_Connector_B (J7.F36), FPGA_HPCC_B_DPs (U16.T18)
HPCC_B_44_N: HPCC_Connector_B (J7.G3), FPGA_HPCC_B_DPs (U16.F8)
HPCC_B_44_P: HPCC_Connector_B (J7.G2), FPGA_HPCC_B_DPs (U16.F9)
HPCC_B_45_N: HPCC_Connector_B (J7.G7), FPGA_HPCC_B_DPs (U16.D10)
HPCC_B_45_P: HPCC_Connector_B (J7.G6), FPGA_HPCC_B_DPs (U16.E10)
HPCC_B_46_N: HPCC_Connector_B (J7.G11), FPGA_HPCC_B_DPs (U16.F12)
HPCC_B_46_P: HPCC_Connector_B (J7.G10), FPGA_HPCC_B_DPs (U16.G12)
HPCC_B_47_N: HPCC_Connector_B (J7.G15), FPGA_HPCC_B_DPs (U16.G14)
HPCC_B_47_P: HPCC_Connector_B (J7.G14), FPGA_HPCC_B_DPs (U16.H14)
HPCC_B_48_N: HPCC_Connector_B (J7.G19), FPGA_HPCC_B_DPs (U16.G16)
HPCC_B_48_P: HPCC_Connector_B (J7.G18), FPGA_HPCC_B_DPs (U16.H16)
HPCC_B_49_N: HPCC_Connector_B (J7.G23), FPGA_HPCC_B_DPs (U16.H18)
HPCC_B_49_P: HPCC_Connector_B (J7.G22), FPGA_HPCC_B_DPs (U16.H17)
HPCC_B_50_N: HPCC_Connector_B (J7.G27), FPGA_HPCC_B_DPs (U16.K18)
HPCC_B_50_P: HPCC_Connector_B (J7.G26), FPGA_HPCC_B_DPs (U16.L17)
HPCC_B_51_N: HPCC_Connector_B (J7.G31), FPGA_HPCC_B_DPs (U16.M20)
HPCC_B_51_P: HPCC_Connector_B (J7.G30), FPGA_HPCC_B_DPs (U16.N19)
HPCC_B_52_N: HPCC_Connector_B (J7.G35), FPGA_HPCC_B_DPs (U16.P20)
HPCC_B_52_P: HPCC_Connector_B (J7.G34), FPGA_HPCC_B_DPs (U16.P19)
HPCC_B_53_N: HPCC_Connector_B (J7.G39), FPGA_HPCC_B_DPs (U16.U20)
HPCC_B_53_P: HPCC_Connector_B (J7.G38), FPGA_HPCC_B_DPs (U16.U19)
HPCC_B_54_N: HPCC_Connector_B (J7.H5), FPGA_HPCC_B_DPs (U16.G9)
HPCC_B_54_P: HPCC_Connector_B (J7.H4), FPGA_HPCC_B_DPs (U16.G10)
HPCC_B_55_N: HPCC_Connector_B (J7.H9), FPGA_HPCC_B_DPs (U16.F10)
HPCC_B_55_P: HPCC_Connector_B (J7.H8), FPGA_HPCC_B_DPs (U16.G11)
HPCC_B_56_N: HPCC_Connector_B (J7.H13), FPGA_HPCC_B_DPs (U16.F13)
HPCC_B_56_P: HPCC_Connector_B (J7.H12), FPGA_HPCC_B_DPs (U16.F14)
HPCC_B_57_N: HPCC_Connector_B (J7.H17), FPGA_HPCC_B_DPs (U16.F15)
HPCC_B_57_P: HPCC_Connector_B (J7.H16), FPGA_HPCC_B_DPs (U16.G15)
HPCC_B_58_N: HPCC_Connector_B (J7.H21), FPGA_HPCC_B_DPs (U16.J16)
HPCC_B_58_P: HPCC_Connector_B (J7.H20), FPGA_HPCC_B_DPs (U16.J15)
HPCC_B_59_N: HPCC_Connector_B (J7.H25), FPGA_HPCC_B_DPs (U16.N17)
HPCC_B_59_P: HPCC_Connector_B (J7.H24), FPGA_HPCC_B_DPs (U16.P16)
HPCC_B_60_N: HPCC_Connector_B (J7.H29), FPGA_HPCC_B_DPs (U16.P18)
HPCC_B_60_P: HPCC_Connector_B (J7.H28), FPGA_HPCC_B_DPs (U16.R18)
HPCC_B_61_N: HPCC_Connector_B (J7.H33), FPGA_HPCC_B_DPs (U16.R17)
HPCC_B_61_P: HPCC_Connector_B (J7.H32), FPGA_HPCC_B_DPs (U16.R16)
HPCC_B_62_N: HPCC_Connector_B (J7.H37), FPGA_HPCC_B_DPs (U16.R20)
HPCC_B_62_P: HPCC_Connector_B (J7.H36), FPGA_HPCC_B_DPs (U16.T20)
HPCC_B_63_N: HPCC_Connector_B (J7.J3), FPGA_HPCC_B_DPs (U16.A8)
HPCC_B_63_P: HPCC_Connector_B (J7.J2), FPGA_HPCC_B_DPs (U16.A9)
HPCC_B_64_N: HPCC_Connector_B (J7.J7), FPGA_HPCC_B_DPs (U16.H8)
HPCC_B_64_P: HPCC_Connector_B (J7.J6), FPGA_HPCC_B_DPs (U16.H9)
HPCC_B_65_N: HPCC_Connector_B (J7.J11), FPGA_HPCC_B_DPs (U16.J10)
HPCC_B_65_P: HPCC_Connector_B (J7.J10), FPGA_HPCC_B_DPs (U16.J11)
HPCC_B_66_N: HPCC_Connector_B (J7.J15), FPGA_HPCC_B_DPs (U16.H11)
HPCC_B_66_P: HPCC_Connector_B (J7.J14), FPGA_HPCC_B_DPs (U16.H12)
HPCC_B_67_N: HPCC_Connector_B (J7.J19), FPGA_HPCC_B_DPs (U16.H13)
HPCC_B_67_P: HPCC_Connector_B (J7.J18), FPGA_HPCC_B_DPs (U16.J13)
HPCC_B_68_N: HPCC_Connector_B (J7.J23), FPGA_HPCC_B_DPs (U16.F20)
HPCC_B_68_P: HPCC_Connector_B (J7.J22), FPGA_HPCC_B_DPs (U16.G19)
HPCC_B_69_N: HPCC_Connector_B (J7.J27), FPGA_HPCC_B_DPs (U16.M19)
HPCC_B_69_P: HPCC_Connector_B (J7.J26), FPGA_HPCC_B_DPs (U16.N18)
HPCC_B_70_N: HPCC_Connector_B (J7.J31), FPGA_HPCC_B_DPs (U16.P21)
HPCC_B_70_P: HPCC_Connector_B (J7.J30), FPGA_HPCC_B_DPs (U16.R21)
HPCC_B_71_N: HPCC_Connector_B (J7.J35), FPGA_HPCC_B_DPs (U16.T17)
HPCC_B_71_P: HPCC_Connector_B (J7.J34), FPGA_HPCC_B_DPs (U16.U17)
HPCC_B_72_N: HPCC_Connector_B (J7.J39), FPGA_HPCC_B_DPs (U16.T23)
HPCC_B_72_P: HPCC_Connector_B (J7.J38), FPGA_HPCC_B_DPs (U16.T22)
HPCC_B_GP01: HPCC_Connector_B (J7.A18), FGPA_Configuration (U16.W26)
HPCC_B_GP02: HPCC_Connector_B (J7.A19), FGPA_Configuration (U16.Y25)
HPCC_B_GP03: HPCC_Connector_B (J7.A22), FGPA_Configuration (U16.AA25)
HPCC_B_GP04: HPCC_Connector_B (J7.A23), FGPA_Configuration (U16.AB25)
HPCC_B_GP05: HPCC_Connector_B (J7.A26), FGPA_Configuration (U16.AB26)
HPCC_B_GP06: HPCC_Connector_B (J7.A27), FGPA_Configuration (U16.AC26)
HPCC_B_GP07: HPCC_Connector_B (J7.A30), FGPA_Configuration (U16.V23)
HPCC_B_GP08: HPCC_Connector_B (J7.A31), FGPA_Configuration (U16.U22)
HPCC_B_GP09: HPCC_Connector_B (J7.A34), FGPA_Configuration (U16.W23)
HPCC_B_GP10: HPCC_Connector_B (J7.A35), FGPA_Configuration (U16.V22)
HPCC_B_GP11: HPCC_Connector_B (J7.A38), FGPA_Configuration (U16.V21)
HPCC_B_GP12: HPCC_Connector_B (J7.A39), FGPA_Configuration (U16.W21)
HPCC_B_GP13: HPCC_Connector_B (J7.B4), FGPA_Configuration (U16.U21)
HPCC_B_GP14: HPCC_Connector_B (J7.B5), FGPA_Configuration (U16.U24)
HPCC_B_GP15: HPCC_Connector_B (J7.B8), FGPA_Configuration (U16.V24)
HPCC_B_GP16: HPCC_Connector_B (J7.B9), FGPA_Configuration (U16.U25)
HPCC_B_GP17: HPCC_Connector_B (J7.B12), FGPA_Configuration (U16.U26)
HPCC_B_GP18: HPCC_Connector_B (J7.B13), FGPA_Configuration (U16.W24)
HPCC_B_GP19: HPCC_Connector_B (J7.B16), FGPA_Configuration (U16.V26)
HPCC_B_GP20: HPCC_Connector_B (J7.B17), FGPA_Configuration (U16.W25)
HPCC_B_I2C_SCL: I2C_Switch_EEPROM (R43.1 U3.4), HPCC_Connector_B (J7.A14)
HPCC_B_I2C_SDA: I2C_Switch_EEPROM (R42.1 U3.3), HPCC_Connector_B (J7.A15)
HPCC_B_JTAG_TCK: HPCC_Connector_B (J7.A3), Miscellaneous_Functions (J10.4)
HPCC_B_JTAG_TDI: HPCC_Connector_B (J7.A7), Miscellaneous_Functions (J10.3)
HPCC_B_JTAG_TDO: HPCC_Connector_B (J7.A6), Miscellaneous_Functions (J10.6)
HPCC_B_JTAG_TMS: HPCC_Connector_B (J7.A2), Miscellaneous_Functions (J10.2)
HPCC_B_JTAG_TRST: HPCC_Connector_B (J7.A10), Miscellaneous_Functions (R135.2)
I2C_FPGA_SCL: I2C_Switch_EEPROM (R38.1 U3.19), FGPA_Configuration (U16.A24)
I2C_FPGA_SDA: I2C_Switch_EEPROM (R37.1 U3.20), FGPA_Configuration (U16.A23)
MC_IND_1G: Management_RP2040 (U1.35), Power_Input_Indicators (D2.3)
MC_IND_1O: Management_RP2040 (U1.36), FGPA_Configuration (U16.J26), Power_Input_Indicators (D2.1)
MC_IND_2G: Management_RP2040 (U1.37), Power_Input_Indicators (D3.3)
MC_IND_2O: Management_RP2040 (U1.38), FGPA_Configuration (U16.H26), Power_Input_Indicators (D3.1)
MC_IND_3G: Management_RP2040 (U1.39), Power_Input_Indicators (D4.3)
MC_IND_3O: Management_RP2040 (U1.40), FGPA_Configuration (U16.H21), Power_Input_Indicators (D4.1)
MST_PWR_GOOD: HPCC_Connector_A (J6.B1), HPCC_Connector_B (J7.B1), Management_RP2040 (R3.1 U1.2)
OSC_PROG_I2C_SCL: I2C_Switch_EEPROM (R51.1 U3.13), Miscellaneous_Functions (U19.2)
OSC_PROG_I2C_SDA: I2C_Switch_EEPROM (R50.1 U3.12), Miscellaneous_Functions (U19.1)
POWER_I2C_SCL: PMIC_3V3 (U11.13), PMIC_2V5 (U10.13), PMIC_1V8 (U9.13), PMIC_1V0 (U8.13), I2C_Temperature_Sensors (U5.1 U6.1 U7.1), Management_RP2040 (R1.1 U1.28), Power_Input_Indicators (J3.11)
POWER_I2C_SDA: PMIC_3V3 (U11.12), PMIC_2V5 (U10.12), PMIC_1V8 (U9.12), PMIC_1V0 (U8.12), I2C_Temperature_Sensors (U5.6 U6.6 U7.4 U7.6), Management_RP2040 (R2.1 U1.27), Power_Input_Indicators (J3.13)
PROG_OSC_OUT: FGPA_Configuration (U16.Y23), Miscellaneous_Functions (U19.4)
PWR_INMOD_RES: Management_RP2040 (U1.34), Power_Input_Indicators (J3.14 R24.1)
PWR_INPUT_SENSE: Management_RP2040 (U1.41), Power_Input_Indicators (R22.1)
QSFP_A_I2C_SCL: I2C_Switch_EEPROM (R45.1 U3.6), QSFP_Connectors (J4.11)
QSFP_A_I2C_SDA: I2C_Switch_EEPROM (R44.1 U3.5), QSFP_Connectors (J4.12)
QSFP_A_IntL/~{RxLos}: QSFP_Connectors (J4.28 R60.1), FGPA_Configuration (U16.K22)
QSFP_A_LPMode/TxDis: QSFP_Connectors (J4.31), FGPA_Configuration (U16.L23)
QSFP_A_~{ModPrs}: QSFP_Connectors (J4.27 R58.1), FGPA_Configuration (U16.L22)
QSFP_A_~{ModSel}: QSFP_Connectors (J4.8), FGPA_Configuration (U16.J23)
QSFP_A_~{Reset}: QSFP_Connectors (J4.9 R56.1), FGPA_Configuration (U16.K23)
QSFP_A_RX1_N: QSFP_Connectors (J4.18), FPGA_GTXs (U16.R3)
QSFP_A_RX1_P: QSFP_Connectors (J4.17), FPGA_GTXs (U16.R4)
QSFP_A_RX2_N: QSFP_Connectors (J4.21), FPGA_GTXs (U16.N3)
QSFP_A_RX2_P: QSFP_Connectors (J4.22), FPGA_GTXs (U16.N4)
QSFP_A_RX3_N: QSFP_Connectors (J4.15), FPGA_GTXs (U16.L3)
QSFP_A_RX3_P: QSFP_Connectors (J4.14), FPGA_GTXs (U16.L4)
QSFP_A_RX4_N: QSFP_Connectors (J4.24), FPGA_GTXs (U16.J3)
QSFP_A_RX4_P: QSFP_Connectors (J4.25), FPGA_GTXs (U16.J4)
QSFP_A_TX1_N: QSFP_Connectors (J4.37), FPGA_GTXs (U16.P2)
QSFP_A_TX1_P: QSFP_Connectors (J4.36), FPGA_GTXs (U16.P1)
QSFP_A_TX2_N: QSFP_Connectors (J4.2), FPGA_GTXs (U16.M2)
QSFP_A_TX2_P: QSFP_Connectors (J4.3), FPGA_GTXs (U16.M1)
QSFP_A_TX3_N: QSFP_Connectors (J4.34), FPGA_GTXs (U16.K2)
QSFP_A_TX3_P: QSFP_Connectors (J4.33), FPGA_GTXs (U16.K1)
QSFP_A_TX4_N: QSFP_Connectors (J4.5), FPGA_GTXs (U16.H2)
QSFP_A_TX4_P: QSFP_Connectors (J4.6), FPGA_GTXs (U16.H1)
QSFP_B_I2C_SCL: I2C_Switch_EEPROM (R47.1 U3.8), QSFP_Connectors (J5.11)
QSFP_B_I2C_SDA: I2C_Switch_EEPROM (R46.1 U3.7), QSFP_Connectors (J5.12)
QSFP_B_IntL/~{RxLos}: QSFP_Connectors (J5.28 R61.1), FGPA_Configuration (U16.J21)
QSFP_B_LPMode/TxDis: QSFP_Connectors (J5.31), FGPA_Configuration (U16.J25)
QSFP_B_~{ModPrs}: QSFP_Connectors (J5.27 R59.1), FGPA_Configuration (U16.H24)
QSFP_B_~{ModSel}: QSFP_Connectors (J5.8), FGPA_Configuration (U16.J24)
QSFP_B_~{Reset}: QSFP_Connectors (J5.9 R57.1), FGPA_Configuration (U16.H22)
QSFP_B_RX1_N: QSFP_Connectors (J5.18), FPGA_GTXs (U16.G3)
QSFP_B_RX1_P: QSFP_Connectors (J5.17), FPGA_GTXs (U16.G4)
QSFP_B_RX2_N: QSFP_Connectors (J5.21), FPGA_GTXs (U16.E3)
QSFP_B_RX2_P: QSFP_Connectors (J5.22), FPGA_GTXs (U16.E4)
QSFP_B_RX3_N: QSFP_Connectors (J5.15), FPGA_GTXs (U16.C3)
QSFP_B_RX3_P: QSFP_Connectors (J5.14), FPGA_GTXs (U16.C4)
QSFP_B_RX4_N: QSFP_Connectors (J5.24), FPGA_GTXs (U16.B5)
QSFP_B_RX4_P: QSFP_Connectors (J5.25), FPGA_GTXs (U16.B6)
QSFP_B_TX1_N: QSFP_Connectors (J5.37), FPGA_GTXs (U16.F2)
QSFP_B_TX1_P: QSFP_Connectors (J5.36), FPGA_GTXs (U16.F1)
QSFP_B_TX2_N: QSFP_Connectors (J5.2), FPGA_GTXs (U16.D2)
QSFP_B_TX2_P: QSFP_Connectors (J5.3), FPGA_GTXs (U16.D1)
QSFP_B_TX3_N: QSFP_Connectors (J5.34), FPGA_GTXs (U16.B2)
QSFP_B_TX3_P: QSFP_Connectors (J5.33), FPGA_GTXs (U16.B1)
QSFP_B_TX4_N: QSFP_Connectors (J5.5), FPGA_GTXs (U16.A4)
QSFP_B_TX4_P: QSFP_Connectors (J5.6), FPGA_GTXs (U16.A3)
RP2040_ECLK: Management_RP2040 (U1.20), Management_RP2040_Support (X1.3)
RP2040_RUN: Management_RP2040 (R6.2 TP1.1), Management_RP2040_Support (SW2.1 SW2.2)
RP2040_SPI_~{CS}: Management_RP2040 (U1.56), Management_RP2040_Support (A1.1 R19.2 R20.1)
RP2040_SPI_CLK: Management_RP2040 (U1.52), Management_RP2040_Support (A1.6)
RP2040_SPI_D0: Management_RP2040 (U1.53), Management_RP2040_Support (A1.5)
RP2040_SPI_D1: Management_RP2040 (U1.55), Management_RP2040_Support (A1.2)
RP2040_SPI_D2: Management_RP2040 (U1.54), Management_RP2040_Support (A1.3)
RP2040_SPI_D3: Management_RP2040 (U1.51), Management_RP2040_Support (A1.7)
USB_CONN: Management_RP2040 (U1.29), Management_RP2040_Support (R15.1 R16.2)
USB_N: Management_RP2040 (R4.1), Management_RP2040_Support (J1.A7 J1.B7 U2.3)
USB_P: Management_RP2040 (R5.2), Management_RP2040_Support (J1.A6 J1.B6 U2.1)